# Altium project Rx_rev_B.PrjPcb
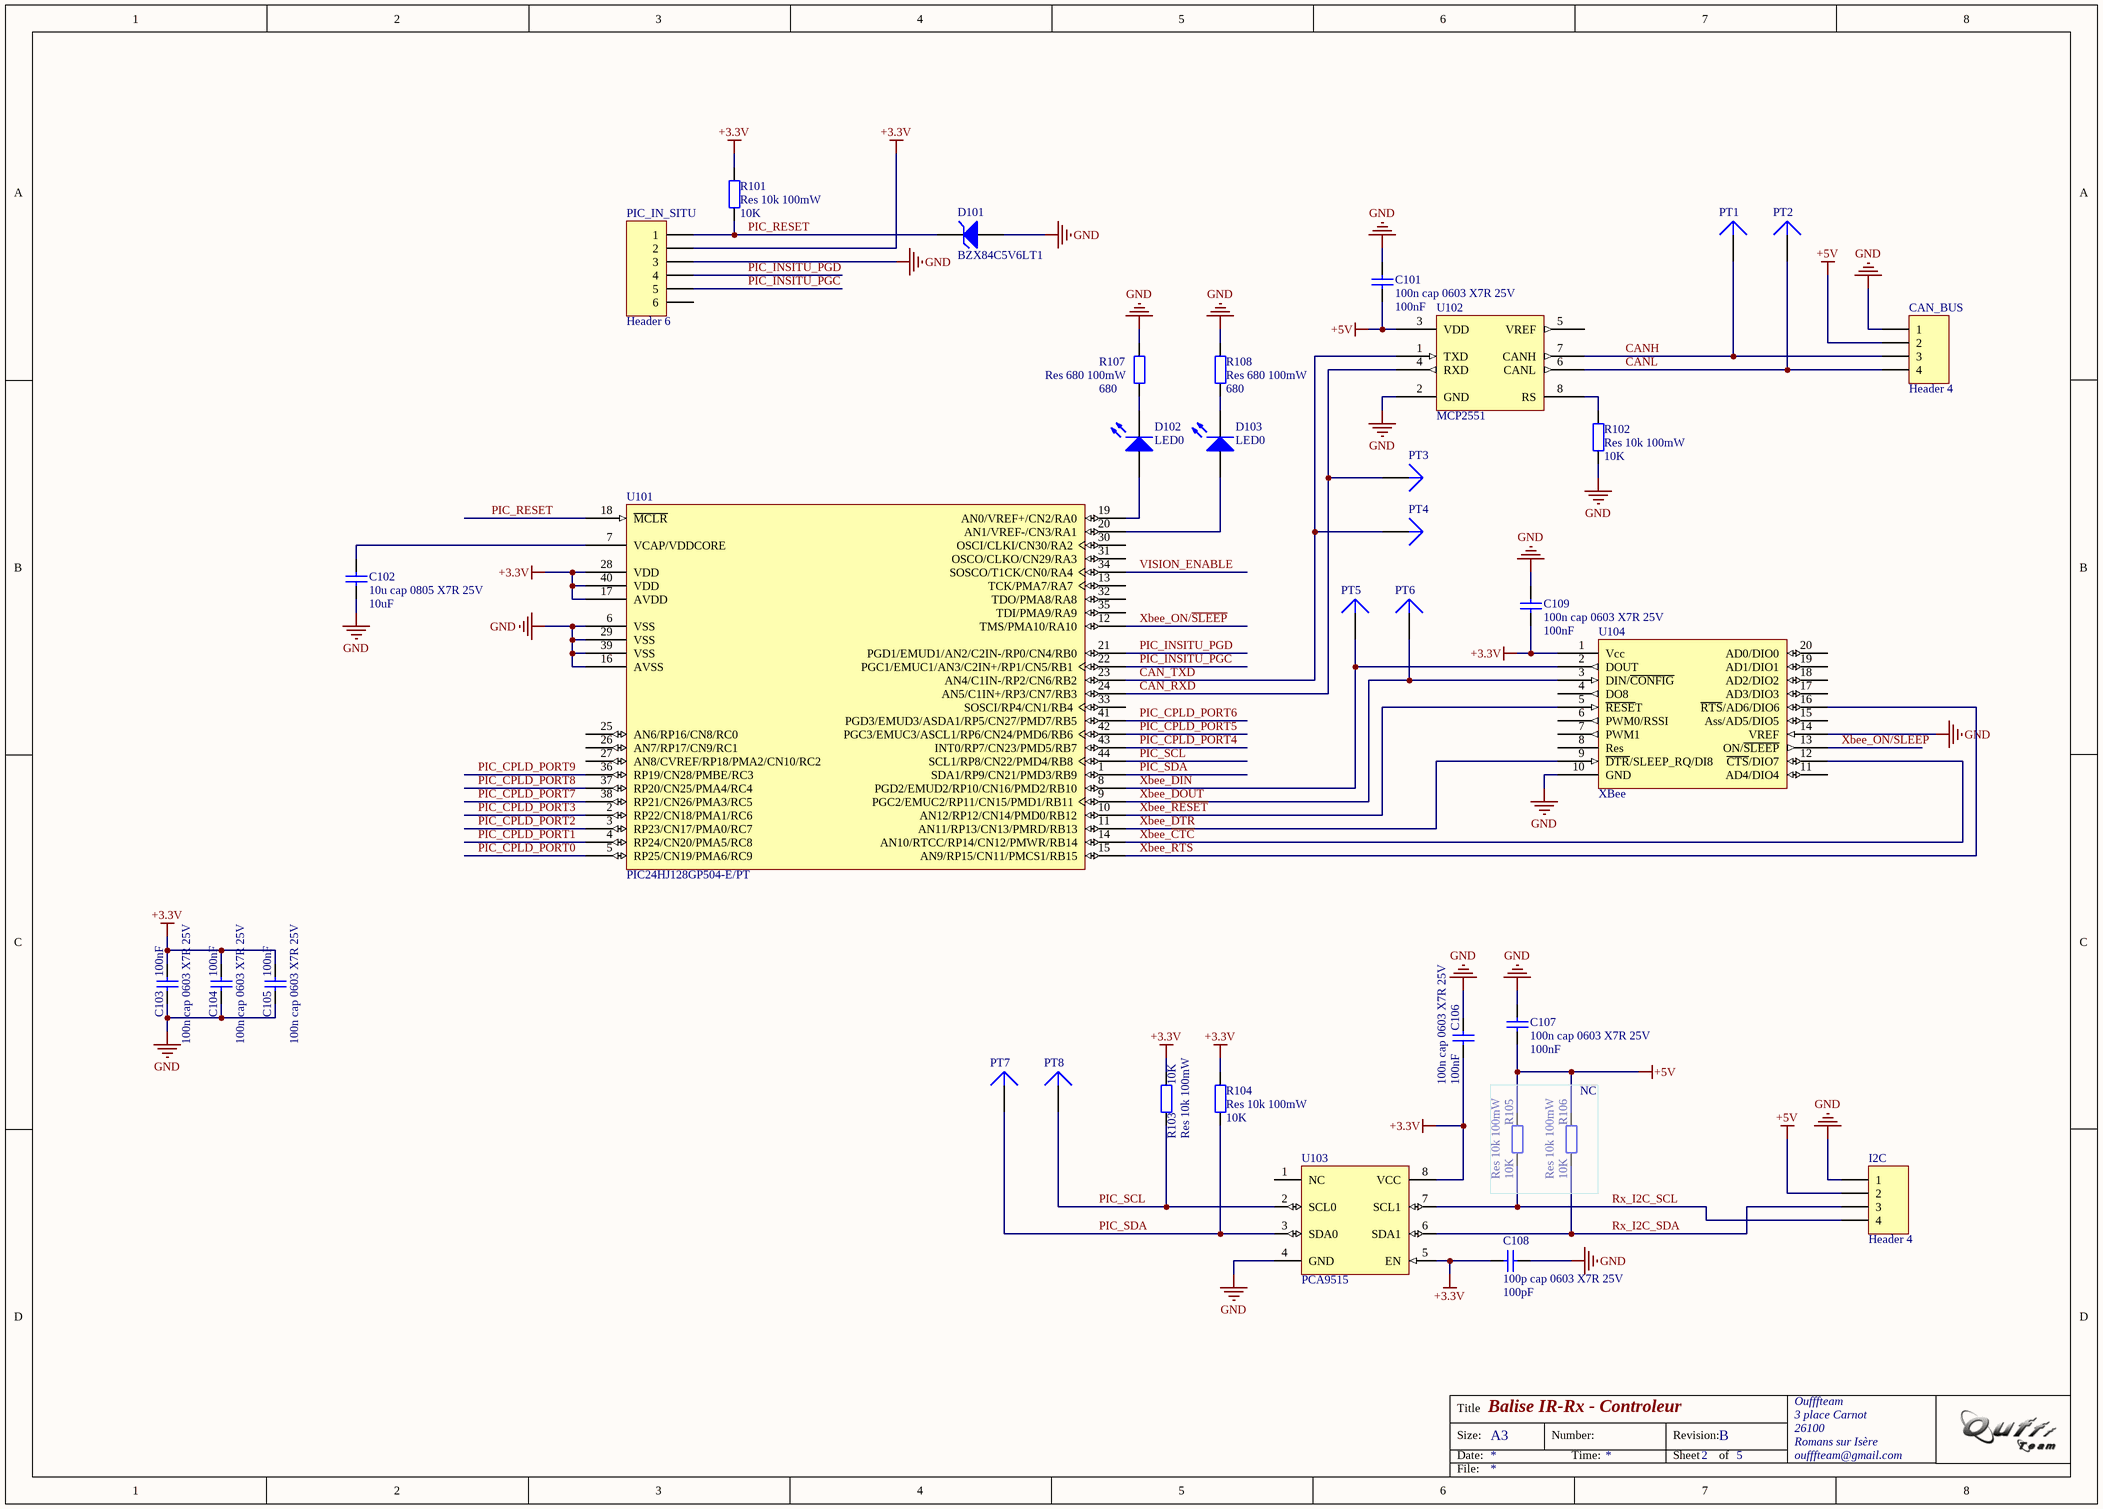
[diagram p0: Rx_micro.SchDoc]
5 sheets, 173 parts. Net scope: global (net labels, ports and power ports of the same name join across sheets).
Board file: Rx_pcb.PcbDoc
Sheets:
  Rx_micro.SchDoc
  Rx_logic.SchDoc
  Rx_power.SchDoc
  Rx_syno.SchDoc
  Rx_TSOP.SchDoc

## Sheet Rx_micro.SchDoc: Balise IR-Rx - Controleur
size A3; Author: B Labbe; CompanyName: Oufffteam; DrawnBy: B Labbe; Engineer: B Labbe; Organization: Oufffteam; Address1: L3, 12a Rodborough Rd; Address2: Frenchs Forest; Address3: NSW; Address4: Australia 2086; Revision: B; SheetNumber: 2; SheetTotal: 5; DocumentName: Balise IR-Rx - Controleur

### Parts
C101  100n cap 0603 X7R 25V  value 100nF  [0603]
C102  10u cap 0805 X7R 25V  value 10uF  [0805]
C103  100n cap 0603 X7R 25V  value 100nF  [0603]
C104  100n cap 0603 X7R 25V  value 100nF  [0603]
C105  100n cap 0603 X7R 25V  value 100nF  [0603]
C106  100n cap 0603 X7R 25V  value 100nF  [1608[0603]]
C107  100n cap 0603 X7R 25V  value 100nF  [1608[0603]]
C108  100p cap 0603 X7R 25V  value 100pF  [1608[0603]]
C109  100n cap 0603 X7R 25V  value 100nF  [0603]
CAN_BUS  Header 4  [HDR1X4]
D101  BZX84C5V6LT1  [318-07]
D102  LED0  [0603]
D103  LED0  [0603]
I2C  Header 4  [HDR1X4]
PIC_IN_SITU  Header 6  [HDR1X6]
PT1  Plug  [TP]  (value not drawn)
PT2  Plug  [TP]  (value not drawn)
PT3  Plug  [TP]  (value not drawn)
PT4  Plug  [TP]  (value not drawn)
PT5  Plug  [TP]  (value not drawn)
PT6  Plug  [TP]  (value not drawn)
PT7  Plug  [TP]  (value not drawn)
PT8  Plug  [TP]  (value not drawn)
R101  Res 10k 100mW  value 10K  [0603]
R102  Res 10k 100mW  value 10K  [0603]
R103  Res 10k 100mW  value 10K  [0603]
R104  Res 10k 100mW  value 10K  [0603]
R105  Res 10k 100mW  value 10K  [1608[0603]]
R106  Res 10k 100mW  value 10K  [1608[0603]]
R107  Res 680 100mW  value 680  [0603]
R108  Res 680 100mW  value 680  [0603]
U101  PIC24HJ128GP504-E/PT  [TQFP-PT44_N]
U102  MCP2551  [SOIC150-8_N]
U103  PCA9515  [TSSOP-8]
U104  XBee  [XBee_SM]

### Nets
+3.3V: C103.2 C104.2 C105.2 C106.1 C108.2 C109.1 PIC_IN_SITU.2 R101.2 R103.2 R104.2 U101.17(AVDD) U101.28(VDD) U101.40(VDD) U103.5(EN) U103.8(VCC) U104.1(Vcc)
+5V: C101.1 C107.2 CAN_BUS.2 I2C.2 R105.2 R106.2 U102.3(VDD)
GND: C101.2 C102.1 C103.1 C104.1 C105.1 C106.2 C107.1 C108.1 C109.2 CAN_BUS.1 D101.1(A) I2C.1 PIC_IN_SITU.3 R102.1 R107.2 R108.2 U101.6(VSS) U101.16(AVSS) U101.29(VSS) U101.39(VSS) U102.2(GND) U103.4(GND) U104.10(GND) U104.14(VREF)
CAN_RXD: PT3.1 U101.24(AN5/C1IN+/RP3/CN7/RB3) U102.4(RXD)
CAN_TXD: PT4.1 U101.23(AN4/C1IN-/RP2/CN6/RB2) U102.1(TXD)
CANH: CAN_BUS.3 PT1.1 U102.7(CANH)
CANL: CAN_BUS.4 PT2.1 U102.6(CANL)
PIC_CPLD_PORT0: U101.5(RP25/CN19/PMA6/RC9)
PIC_CPLD_PORT1: U101.4(RP24/CN20/PMA5/RC8)
PIC_CPLD_PORT2: U101.3(RP23/CN17/PMA0/RC7)
PIC_CPLD_PORT3: U101.2(RP22/CN18/PMA1/RC6)
PIC_CPLD_PORT4: U101.43(INT0/RP7/CN23/PMD5/RB7)
PIC_CPLD_PORT5: U101.42(PGC3/EMUC3/ASCL1/RP6/CN24/PMD6/RB6)
PIC_CPLD_PORT6: U101.41(PGD3/EMUD3/ASDA1/RP5/CN27/PMD7/RB5)
PIC_CPLD_PORT7: U101.38(RP21/CN26/PMA3/RC5)
PIC_CPLD_PORT8: U101.37(RP20/CN25/PMA4/RC4)
PIC_CPLD_PORT9: U101.36(RP19/CN28/PMBE/RC3)
PIC_INSITU_PGC: PIC_IN_SITU.5 U101.22(PGC1/EMUC1/AN3/C2IN+/RP1/CN5/RB1)
PIC_INSITU_PGD: PIC_IN_SITU.4 U101.21(PGD1/EMUD1/AN2/C2IN-/RP0/CN4/RB0)
PIC_RESET: D101.3(K) PIC_IN_SITU.1 R101.1 U101.18(~{MCLR})
PIC_SCL: PT8.1 R103.1 U101.44(SCL1/RP8/CN22/PMD4/RB8) U103.2(SCL0)
PIC_SDA: PT7.1 R104.1 U101.1(SDA1/RP9/CN21/PMD3/RB9) U103.3(SDA0)
Rx_I2C_SCL: I2C.4 R105.1 U103.7(SCL1)
Rx_I2C_SDA: I2C.3 R106.1 U103.6(SDA1)
VISION_ENABLE: U101.34(SOSCO/T1CK/CN0/RA4)
Xbee_~{CTC}: U101.14(AN10/RTCC/RP14/CN12/PMWR/RB14) U104.12(~{CTS}/DIO7)
Xbee_DIN: PT5.1 U101.8(PGD2/EMUD2/RP10/CN16/PMD2/RB10) U104.2(DOUT)
Xbee_DOUT: PT6.1 U101.9(PGC2/EMUC2/RP11/CN15/PMD1/RB11) U104.3(DIN/~{CONFIG})
Xbee_DTR: U101.11(AN11/RP13/CN13/PMRD/RB13) U104.9(~{DTR}/SLEEP_RQ/DI8)
Xbee_ON/~{SLEEP}: U101.12(TMS/PMA10/RA10) U104.13(ON/~{SLEEP})
Xbee_~{RESET}: U101.10(AN12/RP12/CN14/PMD0/RB12) U104.5(~{RESE}T)
Xbee_~{RTS}: U101.15(AN9/RP15/CN11/PMCS1/RB15) U104.16(~{RTS}/AD6/DIO6)
NetC102_2: C102.2 U101.7(VCAP/VDDCORE)
NetD102_1: D102.1(A) U101.19(AN0/VREF+/CN2/RA0)
NetD102_2: D102.2(K) R107.1
NetD103_1: D103.1(A) U101.20(AN1/VREF-/CN3/RA1)
NetD103_2: D103.2(K) R108.1
NetR102_2: R102.2 U102.8(RS)

Not connected (* = marked no-connect by the designer): PIC_IN_SITU 6; U101 13(TCK/PMA7/RA7) 25(AN6/RP16/CN8/RC0) 26(AN7/RP17/CN9/RC1) 27(AN8/CVREF/RP18/PMA2/CN10/RC2) 30(OSCI/CLKI/CN30/RA2) 31(OSCO/CLKO/CN29/RA3) 32(TDO/PMA8/RA8) 33(SOSCI/RP4/CN1/RB4) 35(TDI/PMA9/RA9); U102 5(VREF); U103 1(NC); U104 4(DO8) 6(PWM0/RSSI) 7(PWM1) 8(Res) 11(AD4/DIO4) 15(Ass/AD5/DIO5) 17(AD3/DIO3) 18(AD2/DIO2) 19(AD1/DIO1) 20(AD0/DIO0)

### Notes on the sheet
- (near R106) NC
- Title
- Size:
- Date:
- A3
- Number:
- Time:
- Revision:
- Sheet
- of
- Oufffteam
- 3 place Carnot
- 26100
- Romans sur Isère
- oufffteam@gmail.com
- File:

### Library data of the parts
C101-C109 = Cap: Capacitor; Published: 8-Jun-2000; LatestRevisionDate: 17-Jul-2002; LatestRevisionNote: Re-released for DXP Platform.; PackageReference: RAD-0.3; Publisher: Altium Limited
CAN_BUS I2C = Header 4: Header, 4-Pin; LatestRevisionDate: 17-Jul-2002; LatestRevisionNote: Re-released for DXP Platform.; Publisher: Altium Limited
D101 = BZX84C5V6LT1: Zener Voltage Regulator Diode; Note: Pin 2 is not connected and not drawn.; Published: 29-Sep-2000; LatestRevisionDate: 17-Jul-2002; LatestRevisionNote: Re-released for DXP Platform.; PackageReference: 318-07; Publisher: Altium Limited; PackageDescription: SOT-23; 3 Leads; Body 3.0 x 2.5 mm, inc. leads (LxW max); ComponentLink1Description: Manufacturer Link; ComponentLink1URL: http://www.onsemi.com/site/products/landing?taxonomyID=194; ComponentLink2Description: Datasheet; ComponentLink2URL: http://www.onsemi.com/pub/Collateral/BZX84C2V4LT1-D.PDF
D102 D103 = LED0: 0603 Led; Published: 8-Jun-2000; LatestRevisionDate: 08-Jul-2005; LatestRevisionNote: Mech Layer 1 removed.; PackageReference: LED-0; Publisher: Altium Limited
PIC_IN_SITU = Header 6: Header, 6-Pin; LatestRevisionDate: 17-Jul-2002; LatestRevisionNote: Re-released for DXP Platform.; Publisher: Altium Limited
R101-R108 = Res2: Resistor; Published: 8-Jun-2000; LatestRevisionDate: 17-Jul-2002; LatestRevisionNote: Re-released for DXP Platform.; PackageReference: AXIAL-0.4; Publisher: Altium Limited
U101 = PIC24HJ128GP504-E/PT: High Speed General Purpose 16-Bit Flash Microcontroller, 128KB Flash, 8KB RAM, 44-Pin TQFP, Extended Temperature; Published: 29-Jan-2009; DatasheetVersion: revB, Mar-2008; PackageVersion: revAW, Oct-2008; PackageReference: TQFP-PT44; Publisher: Altium Limited; PackageDescription: 44-Lead Plastic Thin Quad Flatpack (PT) - 10x10x1mm Body, 2.00mm [TQFP]; Code_JEDEC: MS-026; ComponentLink1Description: Manufacturer Link; ComponentLink1URL: http://www.microchip.com; ComponentLink2Description: Datasheet; ComponentLink2URL: http://ww1.microchip.com/downloads/en/DeviceDoc/70293B.pdf; ComponentLink3Description: Packaging Specification; ComponentLink3URL: http://ww1.microchip.com/downloads/en/PackagingSpec/00049AW.pdf
U102 = MCP2551: High Speed Can Transceiver; Published: 6-Oct-2005; LatestRevisionDate: 13-Apr-2006; LatestRevisionNote: IPC-7351 Footprint Added.; DatasheetVersion: Nov-2003; PackageVersion: Oct-2005; PackageReference: SOIC150-8; Publisher: Altium Limited; PackageDescription: 8-Pin Plastic Narrow Body Small Outline Integrated Circuit 1.27 mm Pitch; Code_JEDEC: MS-012; ComponentLink1Description: Manufacturer Link; ComponentLink1URL: http://www.microchip.com; ComponentLink2Description: Datasheet; ComponentLink2URL: http://ww1.microchip.com/downloads/en/DeviceDoc/21667d.pdf
U103 = PCA9515: DUAL BIDIRECTIONAL I2C BUS AND SMBus REPEATER
U104 = XBee: OEM RF Modules
PT1-PT8 = Plug: LatestRevisionDate: 17-Jul-2002; LatestRevisionNote: Re-released for DXP Platform.; Publisher: Altium Limited

## Sheet Rx_logic.SchDoc: Balise IR-Rx - Logic
size A3; Author: B Labbe; CompanyName: Oufffteam; DrawnBy: B Labbe; Engineer: B Labbe; Organization: Oufffteam; Address1: L3, 12a Rodborough Rd; Address2: Frenchs Forest; Address3: NSW; Address4: Australia 2086; Revision: B; SheetNumber: 3; SheetTotal: 5; DocumentName: Balise IR-Rx - Logic
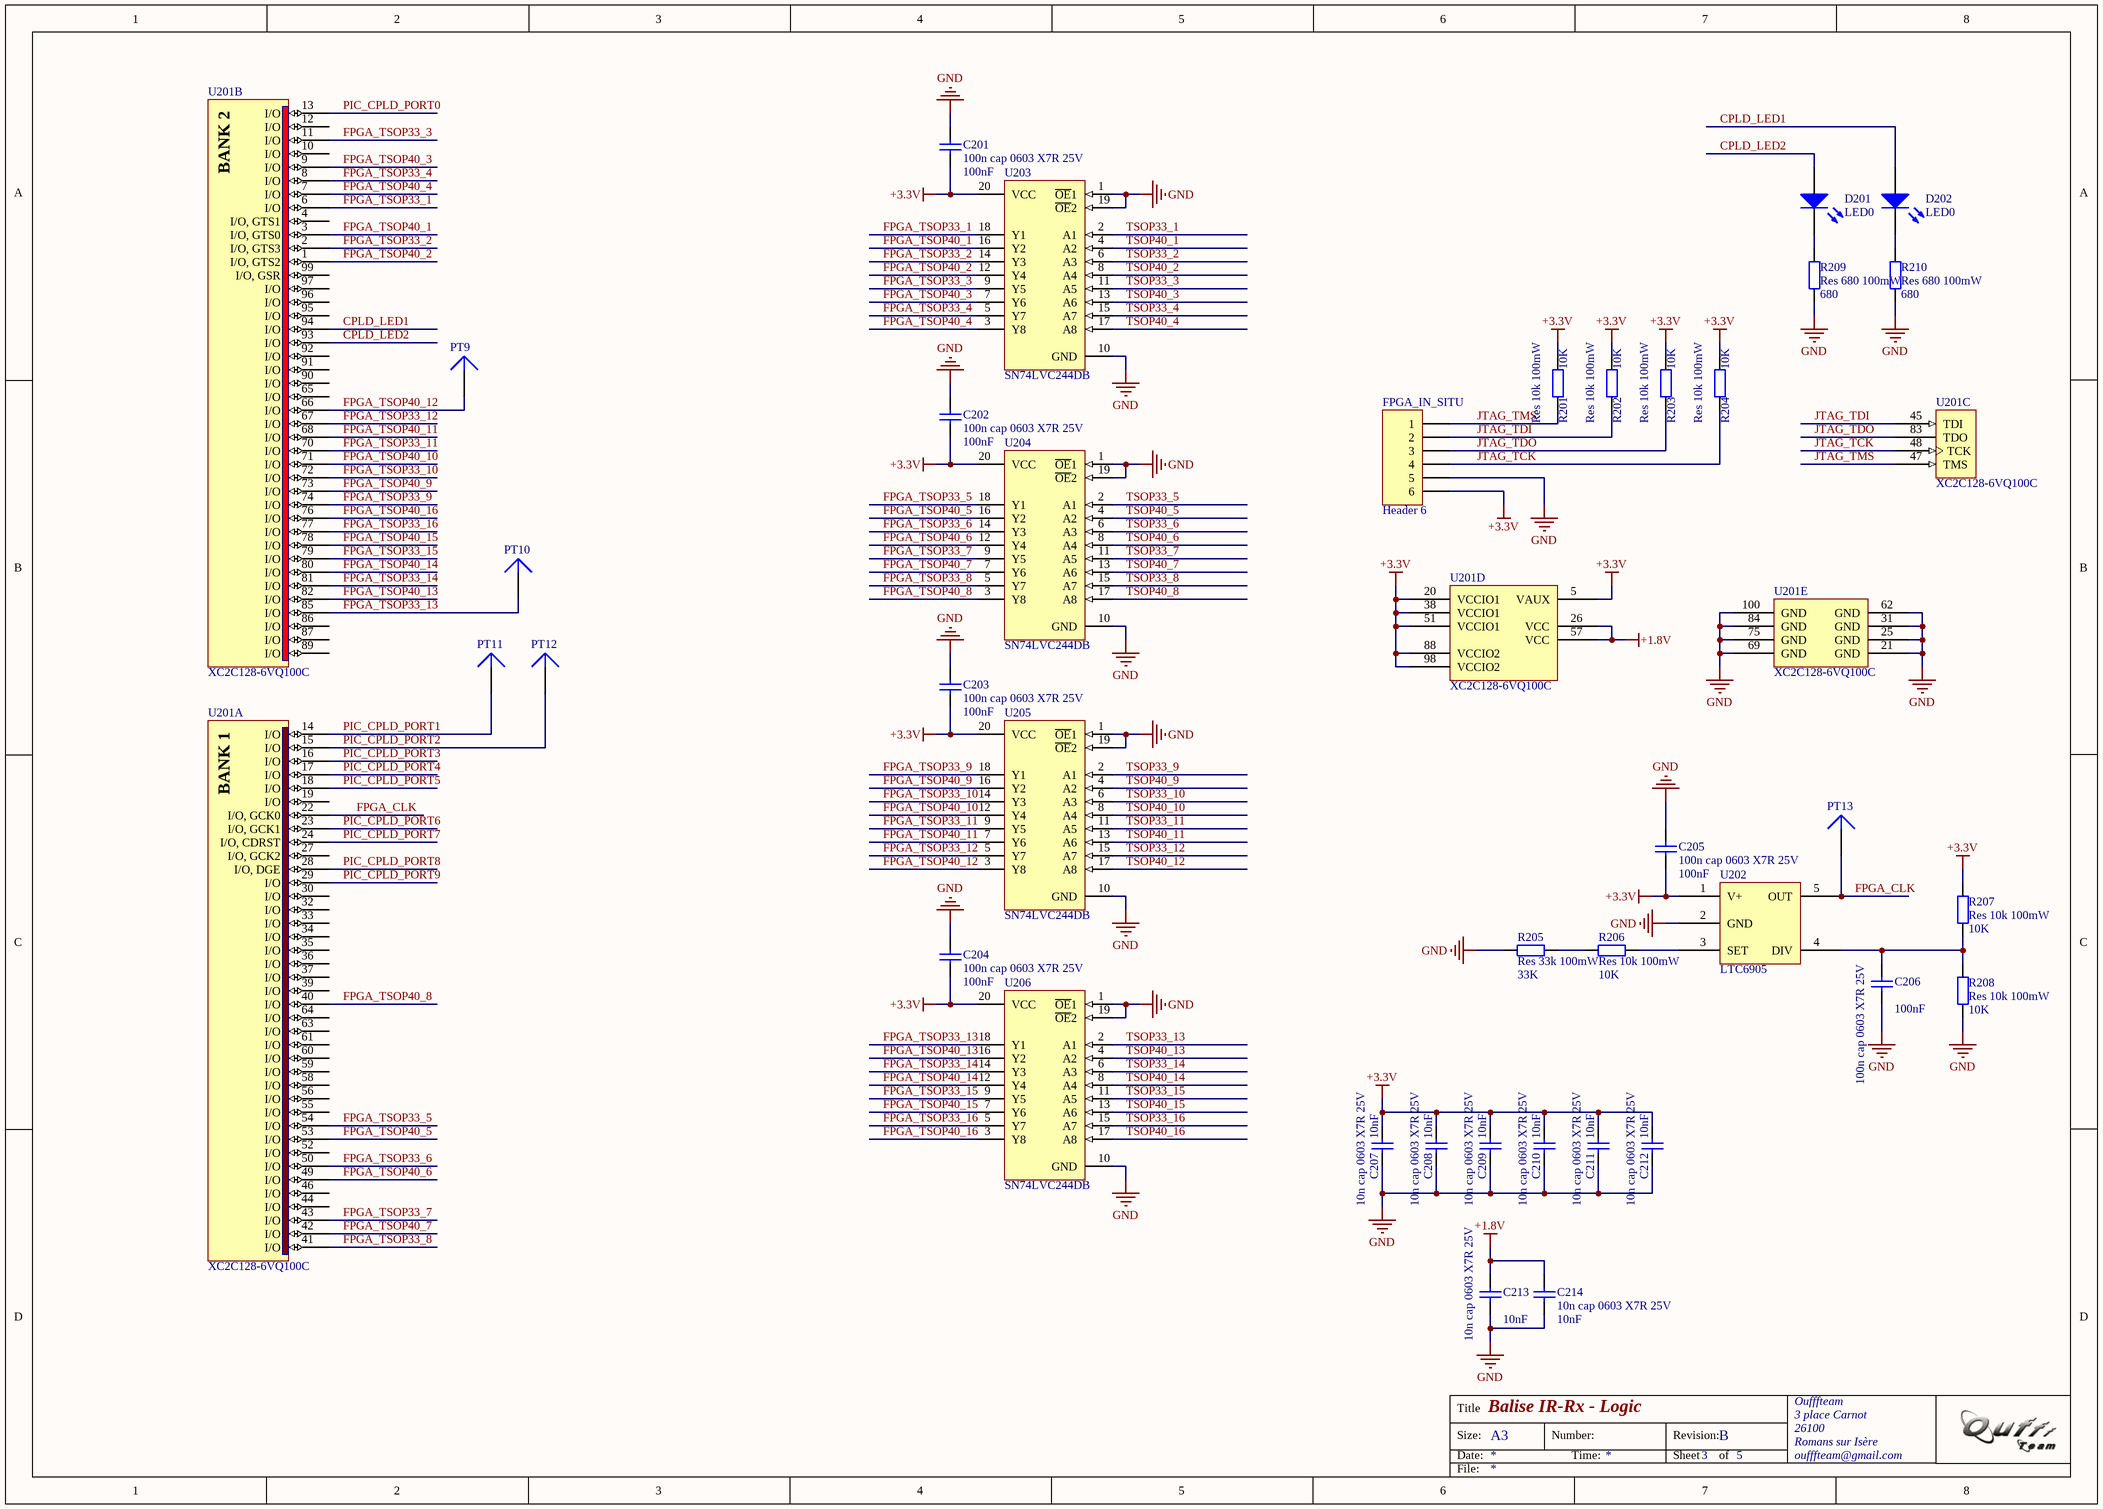
[diagram p1: Rx_logic.SchDoc]

### Parts
C201  100n cap 0603 X7R 25V  value 100nF  [0603]
C202  100n cap 0603 X7R 25V  value 100nF  [0603]
C203  100n cap 0603 X7R 25V  value 100nF  [0603]
C204  100n cap 0603 X7R 25V  value 100nF  [0603]
C205  100n cap 0603 X7R 25V  value 100nF  [0603]
C206  100n cap 0603 X7R 25V  value 100nF  [0603]
C207  10n cap 0603 X7R 25V  value 10nF  [0603]
C208  10n cap 0603 X7R 25V  value 10nF  [0603]
C209  10n cap 0603 X7R 25V  value 10nF  [0603]
C210  10n cap 0603 X7R 25V  value 10nF  [0603]
C211  10n cap 0603 X7R 25V  value 10nF  [0603]
C212  10n cap 0603 X7R 25V  value 10nF  [0603]
C213  10n cap 0603 X7R 25V  value 10nF  [0603]
C214  10n cap 0603 X7R 25V  value 10nF  [0603]
D201  LED0  [0603]
D202  LED0  [0603]
FPGA_IN_SITU  Header 6  [HDR1X6]
PT9  Plug  [TP]  (value not drawn)
PT10  Plug  [TP]  (value not drawn)
PT11  Plug  [TP]  (value not drawn)
PT12  Plug  [TP]  (value not drawn)
PT13  Plug  [TP]  (value not drawn)
R201  Res 10k 100mW  value 10K  [0603]
R202  Res 10k 100mW  value 10K  [0603]
R203  Res 10k 100mW  value 10K  [0603]
R204  Res 10k 100mW  value 10K  [0603]
R205  Res 33k 100mW  value 33K  [0603]
R206  Res 10k 100mW  value 10K  [0603]
R207  Res 10k 100mW  value 10K  [0603]
R208  Res 10k 100mW  value 10K  [0603]
R209  Res 680 100mW  value 680  [0603]
R210  Res 680 100mW  value 680  [0603]
U201  XC2C128-6VQ100C  [VQ100_N]  (parts A,B,C,D,E of 5)
U202  LTC6905  [SOT23-5]
U203  SN74LVC244DB  [DB020_N]
U204  SN74LVC244DB  [DB020_N]
U205  SN74LVC244DB  [DB020_N]
U206  SN74LVC244DB  [DB020_N]

### Nets
+1.8V: C213.2 C214.2 U201.26(VCC) U201.57(VCC)
+3.3V: C201.1 C202.1 C203.1 C204.1 C205.1 C207.2 C208.2 C209.2 C210.2 C211.2 C212.2 FPGA_IN_SITU.6 R201.2 R202.2 R203.2 R204.2 R207.2 U201.5(VAUX) U201.20(VCCIO1) U201.38(VCCIO1) U201.51(VCCIO1) U201.88(VCCIO2) U201.98(VCCIO2) U202.1(V+) U203.20(VCC) U204.20(VCC) U205.20(VCC) U206.20(VCC)
GND: C201.2 C202.2 C203.2 C204.2 C205.2 C206.1 C207.1 C208.1 C209.1 C210.1 C211.1 C212.1 C213.1 C214.1 FPGA_IN_SITU.5 R205.1 R208.1 R209.2 R210.2 U201.21(GND) U201.25(GND) U201.31(GND) U201.62(GND) U201.69(GND) U201.75(GND) U201.84(GND) U201.100(GND) U202.2(GND) U203.1(~{OE}1) U203.10(GND) U203.19(~{OE}2) U204.1(~{OE}1) U204.10(GND) U204.19(~{OE}2) U205.1(~{OE}1) U205.10(GND) U205.19(~{OE}2) U206.1(~{OE}1) U206.10(GND) U206.19(~{OE}2)
CPLD_LED1: D202.1(A) U201.94(I/O)
CPLD_LED2: D201.1(A) U201.93(I/O)
FPGA_CLK: PT13.1 U201.22(I/O,_GCK0) U202.5(OUT)
FPGA_TSOP33_1: U201.6(I/O) U203.18(Y1)
FPGA_TSOP33_2: U201.2(I/O,_GTS3) U203.14(Y3)
FPGA_TSOP33_3: U201.11(I/O) U203.9(Y5)
FPGA_TSOP33_4: U201.8(I/O) U203.5(Y7)
FPGA_TSOP33_5: U201.54(I/O) U204.18(Y1)
FPGA_TSOP33_6: U201.50(I/O) U204.14(Y3)
FPGA_TSOP33_7: U201.43(I/O) U204.9(Y5)
FPGA_TSOP33_8: U201.41(I/O) U204.5(Y7)
FPGA_TSOP33_9: U201.74(I/O) U205.18(Y1)
FPGA_TSOP33_10: U201.72(I/O) U205.14(Y3)
FPGA_TSOP33_11: U201.70(I/O) U205.9(Y5)
FPGA_TSOP33_12: U201.67(I/O) U205.5(Y7)
FPGA_TSOP33_13: PT10.1 U201.85(I/O) U206.18(Y1)
FPGA_TSOP33_14: U201.81(I/O) U206.14(Y3)
FPGA_TSOP33_15: U201.79(I/O) U206.9(Y5)
FPGA_TSOP33_16: U201.77(I/O) U206.5(Y7)
FPGA_TSOP40_1: U201.3(I/O,_GTS0) U203.16(Y2)
FPGA_TSOP40_2: U201.1(I/O,_GTS2) U203.12(Y4)
FPGA_TSOP40_3: U201.9(I/O) U203.7(Y6)
FPGA_TSOP40_4: U201.7(I/O) U203.3(Y8)
FPGA_TSOP40_5: U201.53(I/O) U204.16(Y2)
FPGA_TSOP40_6: U201.49(I/O) U204.12(Y4)
FPGA_TSOP40_7: U201.42(I/O) U204.7(Y6)
FPGA_TSOP40_8: U201.40(I/O) U204.3(Y8)
FPGA_TSOP40_9: U201.73(I/O) U205.16(Y2)
FPGA_TSOP40_10: U201.71(I/O) U205.12(Y4)
FPGA_TSOP40_11: U201.68(I/O) U205.7(Y6)
FPGA_TSOP40_12: PT9.1 U201.66(I/O) U205.3(Y8)
FPGA_TSOP40_13: U201.82(I/O) U206.16(Y2)
FPGA_TSOP40_14: U201.80(I/O) U206.12(Y4)
FPGA_TSOP40_15: U201.78(I/O) U206.7(Y6)
FPGA_TSOP40_16: U201.76(I/O) U206.3(Y8)
JTAG_TCK: FPGA_IN_SITU.4 R204.1 U201.48(TCK)
JTAG_TDI: FPGA_IN_SITU.2 R202.1 U201.45(TDI)
JTAG_TDO: FPGA_IN_SITU.3 R203.1 U201.83(TDO)
JTAG_TMS: FPGA_IN_SITU.1 R201.1 U201.47(TMS)
PIC_CPLD_PORT0: U201.13(I/O)
PIC_CPLD_PORT1: PT11.1 U201.14(I/O)
PIC_CPLD_PORT2: PT12.1 U201.15(I/O)
PIC_CPLD_PORT3: U201.16(I/O)
PIC_CPLD_PORT4: U201.17(I/O)
PIC_CPLD_PORT5: U201.18(I/O)
PIC_CPLD_PORT6: U201.23(I/O,_GCK1)
PIC_CPLD_PORT7: U201.24(I/O,_CDRST)
PIC_CPLD_PORT8: U201.28(I/O,_DGE)
PIC_CPLD_PORT9: U201.29(I/O)
TSOP33_1: U203.2(A1)
TSOP33_2: U203.6(A3)
TSOP33_3: U203.11(A5)
TSOP33_4: U203.15(A7)
TSOP33_5: U204.2(A1)
TSOP33_6: U204.6(A3)
TSOP33_7: U204.11(A5)
TSOP33_8: U204.15(A7)
TSOP33_9: U205.2(A1)
TSOP33_10: U205.6(A3)
TSOP33_11: U205.11(A5)
TSOP33_12: U205.15(A7)
TSOP33_13: U206.2(A1)
TSOP33_14: U206.6(A3)
TSOP33_15: U206.11(A5)
TSOP33_16: U206.15(A7)
TSOP40_1: U203.4(A2)
TSOP40_2: U203.8(A4)
TSOP40_3: U203.13(A6)
TSOP40_4: U203.17(A8)
TSOP40_5: U204.4(A2)
TSOP40_6: U204.8(A4)
TSOP40_7: U204.13(A6)
TSOP40_8: U204.17(A8)
TSOP40_9: U205.4(A2)
TSOP40_10: U205.8(A4)
TSOP40_11: U205.13(A6)
TSOP40_12: U205.17(A8)
TSOP40_13: U206.4(A2)
TSOP40_14: U206.8(A4)
TSOP40_15: U206.13(A6)
TSOP40_16: U206.17(A8)
NetC206_2: C206.2 R207.1 R208.2 U202.4(DIV)
NetD201_2: D201.2(K) R209.1
NetD202_2: D202.2(K) R210.1
NetR205_2: R205.2 R206.1
NetR206_2: R206.2 U202.3(SET)

Not connected (* = marked no-connect by the designer): U201 4(I/O,_GTS1) 10(I/O) 12(I/O) 19(I/O) 27(I/O,_GCK2) 30(I/O) 32(I/O) 33(I/O) 34(I/O) 35(I/O) 36(I/O) 37(I/O) 39(I/O) 44(I/O) 46(I/O) 52(I/O) 55(I/O) 56(I/O) 58(I/O) 59(I/O) 60(I/O) 61(I/O) 63(I/O) 64(I/O) 65(I/O) 86(I/O) 87(I/O) 89(I/O) 90(I/O) 91(I/O) 92(I/O) 95(I/O) 96(I/O) 97(I/O) 99(I/O,_GSR)

### Notes on the sheet
- Title
- Size:
- Date:
- A3
- Number:
- Time:
- Revision:
- Sheet
- of
- Oufffteam
- 3 place Carnot
- 26100
- Romans sur Isère
- oufffteam@gmail.com
- File:
- (in symbol XC2C128-6VQ100C, part A) BANK 1
- (in symbol XC2C128-6VQ100C, part B) BANK 2

### Library data of the parts
C201-C214 = Cap: Capacitor; Published: 8-Jun-2000; LatestRevisionDate: 17-Jul-2002; LatestRevisionNote: Re-released for DXP Platform.; PackageReference: RAD-0.3; Publisher: Altium Limited
D201 D202 = LED0: 0603 Led; Published: 8-Jun-2000; LatestRevisionDate: 08-Jul-2005; LatestRevisionNote: Mech Layer 1 removed.; PackageReference: LED-0; Publisher: Altium Limited
FPGA_IN_SITU = Header 6: Header, 6-Pin; LatestRevisionDate: 17-Jul-2002; LatestRevisionNote: Re-released for DXP Platform.; Publisher: Altium Limited
R201-R210 = Res2: Resistor; Published: 8-Jun-2000; LatestRevisionDate: 17-Jul-2002; LatestRevisionNote: Re-released for DXP Platform.; PackageReference: AXIAL-0.4; Publisher: Altium Limited
U201 = XC2C128-6VQ100C: CoolRunner-II, 1.8V, 128 Macrocell CPLD, 100-Pin VQFP, Commercial Grade; ComponentAvailability: Not referenced in latest datasheet.; Published: 23-Sep-2002; LatestRevisionDate: 13-Apr-2006; LatestRevisionNote: IPC-7351 Footprint Added.; DatasheetVersion: ver2.5, Oct-2004; PackageVersion: ver1.2.1, Feb-2007; PackageReference: VQ100; Publisher: Altium Limited; PackageDescription: 100-Pin Very Thin Quad Flat Pack (VQ100); Code_JEDEC: MS-026-AED; ComponentLink1Description: Manufacturer Link; ComponentLink1URL: http://www.xilinx.com/products/silicon_solutions/cplds/coolrunner_series/coolrunner_ii_cplds/overview.htm; ComponentLink2Description: Datasheet; ComponentLink2URL: http://direct.xilinx.com/bvdocs/publications/ds093.pdf
U202 = LTC6905: 17MHz to 170MHz Resistor Set SOT-23 Oscillator
U203-U206 = SN74LVC244DB: Octal Buffer/Driver with 3-State Outputs; ComponentAvailability: Obsolete; Published: 8-Jun-2000; LatestRevisionDate: 16-Oct-2006; LatestRevisionNote: IPC-7351 Footprint Added.; DatasheetVersion: Mar-1994; PackageVersion: May-1999; PackageReference: DB020; Publisher: Altium Limited; PackageDescription: 20-Pin Plastic Small Outline Package 0.65 mm Pitch; Code_JEDEC: MO-150-AE; Code_IPC: SOP65P780-20; ComponentLink1Description: Manufacturer Link; ComponentLink1URL: http://www.ti.com/; ComponentLink2Description: Discontinuation Notice; ComponentLink2URL: http://focus.ti.com/docs/prod/folders/print/sn74lvc244.html
PT9-PT13 = Plug: LatestRevisionDate: 17-Jul-2002; LatestRevisionNote: Re-released for DXP Platform.; Publisher: Altium Limited

## Sheet Rx_power.SchDoc: Balise IR-Rx - Power
size A3; Author: B Labbe; CompanyName: Oufffteam; DrawnBy: B Labbe; Engineer: B Labbe; Organization: Oufffteam; Address1: L3, 12a Rodborough Rd; Address2: Frenchs Forest; Address3: NSW; Address4: Australia 2086; Revision: B; SheetNumber: 4; SheetTotal: 5; DocumentName: Balise IR-Rx - Power
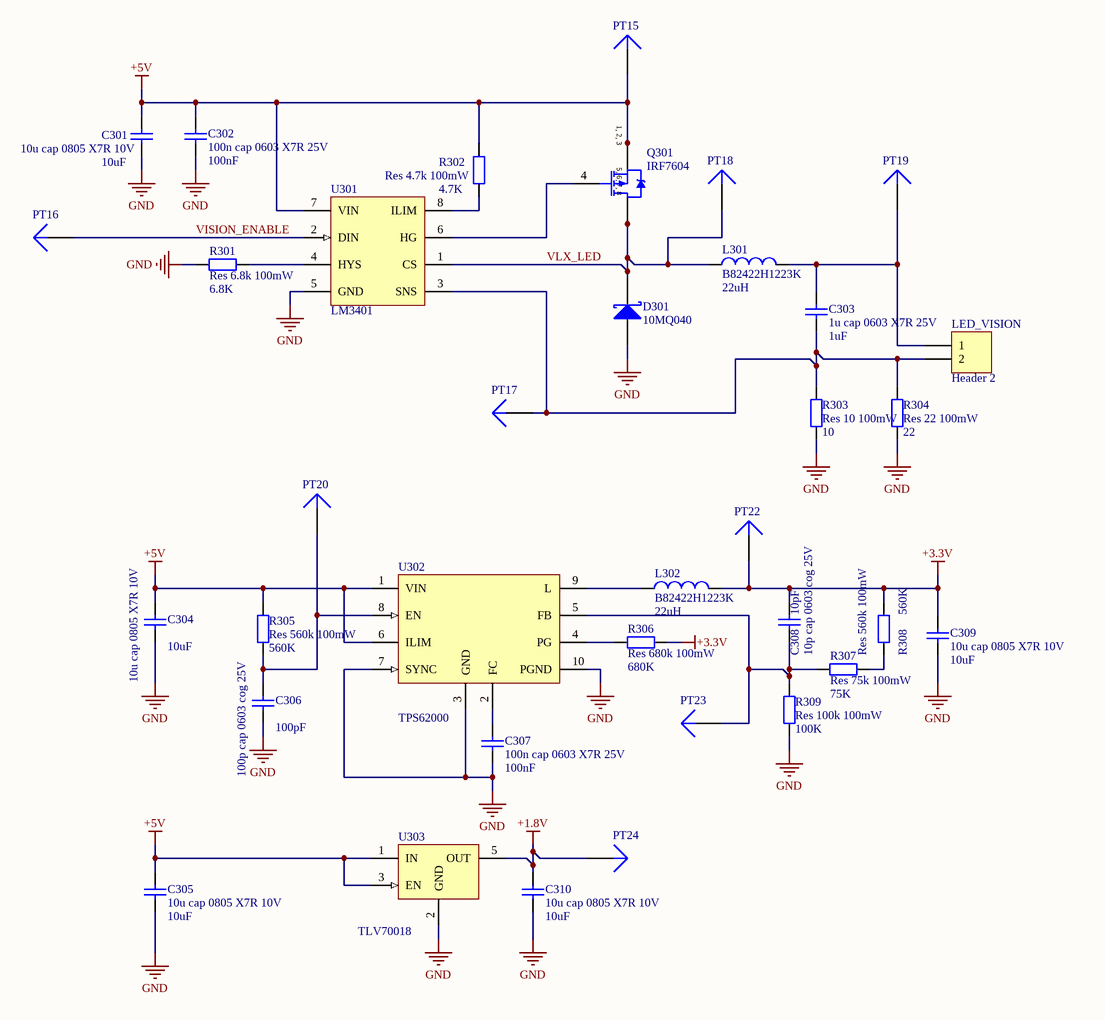
[diagram p2: Rx_power.SchDoc]

### Parts
C301  10u cap 0805 X7R 10V  value 10uF  [0805]
C302  100n cap 0603 X7R 25V  value 100nF  [0603]
C303  1u cap 0603 X7R 25V  value 1uF  [0603]
C304  10u cap 0805 X7R 10V  value 10uF  [0805]
C305  10u cap 0805 X7R 10V  value 10uF  [0805]
C306  100p cap 0603 cog 25V  value 100pF  [0603]
C307  100n cap 0603 X7R 25V  value 100nF  [0603]
C308  10p cap 0603 cog 25V  value 10pF  [0603]
C309  10u cap 0805 X7R 10V  value 10uF  [0805]
C310  10u cap 0805 X7R 10V  value 10uF  [0805]
D301  10MQ040  [D-64]
L301  B82422H1223K  value 22uH  [1210]
L302  B82422H1223K  value 22uH  [1210]
LED_VISION  Header 2  [HDR1X2]
PT15  Plug  [TP]  (value not drawn)
PT16  Plug  [TP]  (value not drawn)
PT17  Plug  [TP]  (value not drawn)
PT18  Plug  [TP]  (value not drawn)
PT19  Plug  [TP]  (value not drawn)
PT20  Plug  [TP]  (value not drawn)
PT22  Plug  [TP]  (value not drawn)
PT23  Plug  [TP]  (value not drawn)
PT24  Plug  [TP]  (value not drawn)
Q301  IRF7604  [Micro8]
R301  Res 6.8k 100mW  value 6.8K  [0603]
R302  Res 4.7k 100mW  value 4.7K  [0603]
R303  Res 10 100mW  value 10  [0603]
R304  Res 22 100mW  value 22  [0603]
R305  Res 560k 100mW  value 560K  [0603]
R306  Res 680k 100mW  value 680K  [0603]
R307  Res 75k 100mW  value 75K  [0603]
R308  Res 560k 100mW  value 560K  [0603]
R309  Res 100k 100mW  value 100K  [0603]
U301  LM3401  [MSOP8]
U302  TPS62000  [MS10]
U303  TLV70018  [SOT23-5]

### Nets
+1.8V: C310.2 PT24.1 U303.5(OUT)
+3.3V: C308.2 C309.2 L302.2 PT22.1 R306.2 R308.2
+5V: C301.2 C302.2 C304.2 C305.2 PT15.1 Q301.1(S) Q301.2(S) Q301.3(S) R302.2 R305.2 U301.7(VIN) U302.1(VIN) U302.6(ILIM) U303.1(IN) U303.3(EN)
GND: C301.1 C302.1 C304.1 C305.1 C306.1 C307.1 C309.1 C310.1 D301.1(A) R301.1 R303.1 R304.1 R309.1 U301.5(GND) U302.3(GND) U302.7(SYNC) U302.10(PGND) U303.2(GND)
VISION_ENABLE: PT16.1 U301.2(DIN)
VLX_LED: D301.2(K) L301.1 PT18.1 Q301.5(D) Q301.6(D) Q301.7(D) Q301.8(D) U301.1(CS)
NetC303_1: C303.1 LED_VISION.2 PT17.1 R303.2 R304.2 U301.3(SNS)
NetC303_2: C303.2 L301.2 LED_VISION.1 PT19.1
NetC306_2: C306.2 PT20.1 R305.1 U302.8(EN)
NetC307_2: C307.2 U302.2(FC)
NetC308_1: C308.1 PT23.1 R307.1 R309.2 U302.5(FB)
NetL302_1: L302.1 U302.9(L)
NetQ301_4: Q301.4(G) U301.6(HG)
NetR301_2: R301.2 U301.4(HYS)
NetR302_1: R302.1 U301.8(ILIM)
NetR306_1: R306.1 U302.4(PG)
NetR307_2: R307.2 R308.1

### Notes on the sheet
- Title
- Size:
- Date:
- A3
- Number:
- Time:
- Revision:
- Sheet
- of
- Oufffteam
- 3 place Carnot
- 26100
- Romans sur Isère
- oufffteam@gmail.com
- File:
- (in symbol IRF7604) 1, 2, 3; 5, 6, 7, 8

### Library data of the parts
C301-C310 = Cap: Capacitor; Published: 8-Jun-2000; LatestRevisionDate: 17-Jul-2002; LatestRevisionNote: Re-released for DXP Platform.; PackageReference: RAD-0.3; Publisher: Altium Limited
D301 = 10MQ040: Schottky Rectifier; Published: 8-Jun-2000; LatestRevisionDate: 17-Jul-2002; LatestRevisionNote: Re-released for DXP Platform.; DatasheetDocument: Dec-1997; PackageReference: D-64; Publisher: Altium Limited; ComponentLink1Description: Manufacturer Link; ComponentLink1URL: http://www.irf.com/; ComponentLink2Description: Datasheet; ComponentLink2URL: http://www.irf.com/product-info/datasheets/data/10mq040n.pdf
L301 L302 = Inductor: Code_IEC: 1005; Published: 8-Jun-2000; LatestRevisionDate: 17-Jul-2002; LatestRevisionNote: Re-released for DXP Platform.; PackageReference: 0402-A; Publisher: Altium Limited; Code_JEITA: 0402
LED_VISION = Header 2: Header, 2-Pin; LatestRevisionDate: 17-Jul-2002; LatestRevisionNote: Re-released for DXP Platform.; Publisher: Altium Limited
Q301 = IRF7604: HEXFET Power MOSFET; Published: 8-Jun-2000; LatestRevisionDate: 04-Mar-2005; LatestRevisionNote: Stylized 3D Model Added.; DatasheetVersion: Dec-1997; PackageReference: Micro8; Publisher: Altium Limited; PackageDescription: Shrink Small Outline; 8 Leads; Body Width 3 mm; Pitch 0.65 mm; ComponentLink1Description: Manufacturer Link; ComponentLink1URL: http://www.irf.com/; ComponentLink2Description: Datasheet; ComponentLink2URL: http://www.irf.com/product-info/datasheets/data/irf7604.pdf
R301-R309 = Res2: Resistor; Published: 8-Jun-2000; LatestRevisionDate: 17-Jul-2002; LatestRevisionNote: Re-released for DXP Platform.; PackageReference: AXIAL-0.4; Publisher: Altium Limited
U301 = LM3401: Hysteretic PFET Controller for High Power LED Drive
U302 = TPS6200x: HIGH-EFFICIENCY STEP-DOWN LOW POWER DC-DC CONVERTER
U303 = TLV700xx: 200-mA, Low-IQ, Low-Dropout Regulator for Portable Devices
PT15-PT20 PT22-PT24 = Plug: LatestRevisionDate: 17-Jul-2002; LatestRevisionNote: Re-released for DXP Platform.; Publisher: Altium Limited

## Sheet Rx_syno.SchDoc: Balise IR-Rx - Synoptique
size A3; Author: B Labbe; CompanyName: Oufffteam; DrawnBy: B Labbe; Engineer: B Labbe; Organization: Oufffteam; Address1: L3, 12a Rodborough Rd; Address2: Frenchs Forest; Address3: NSW; Address4: Australia 2086; Revision: B; SheetNumber: 1; SheetTotal: 5; DocumentName: Balise IR-Rx - Synoptique
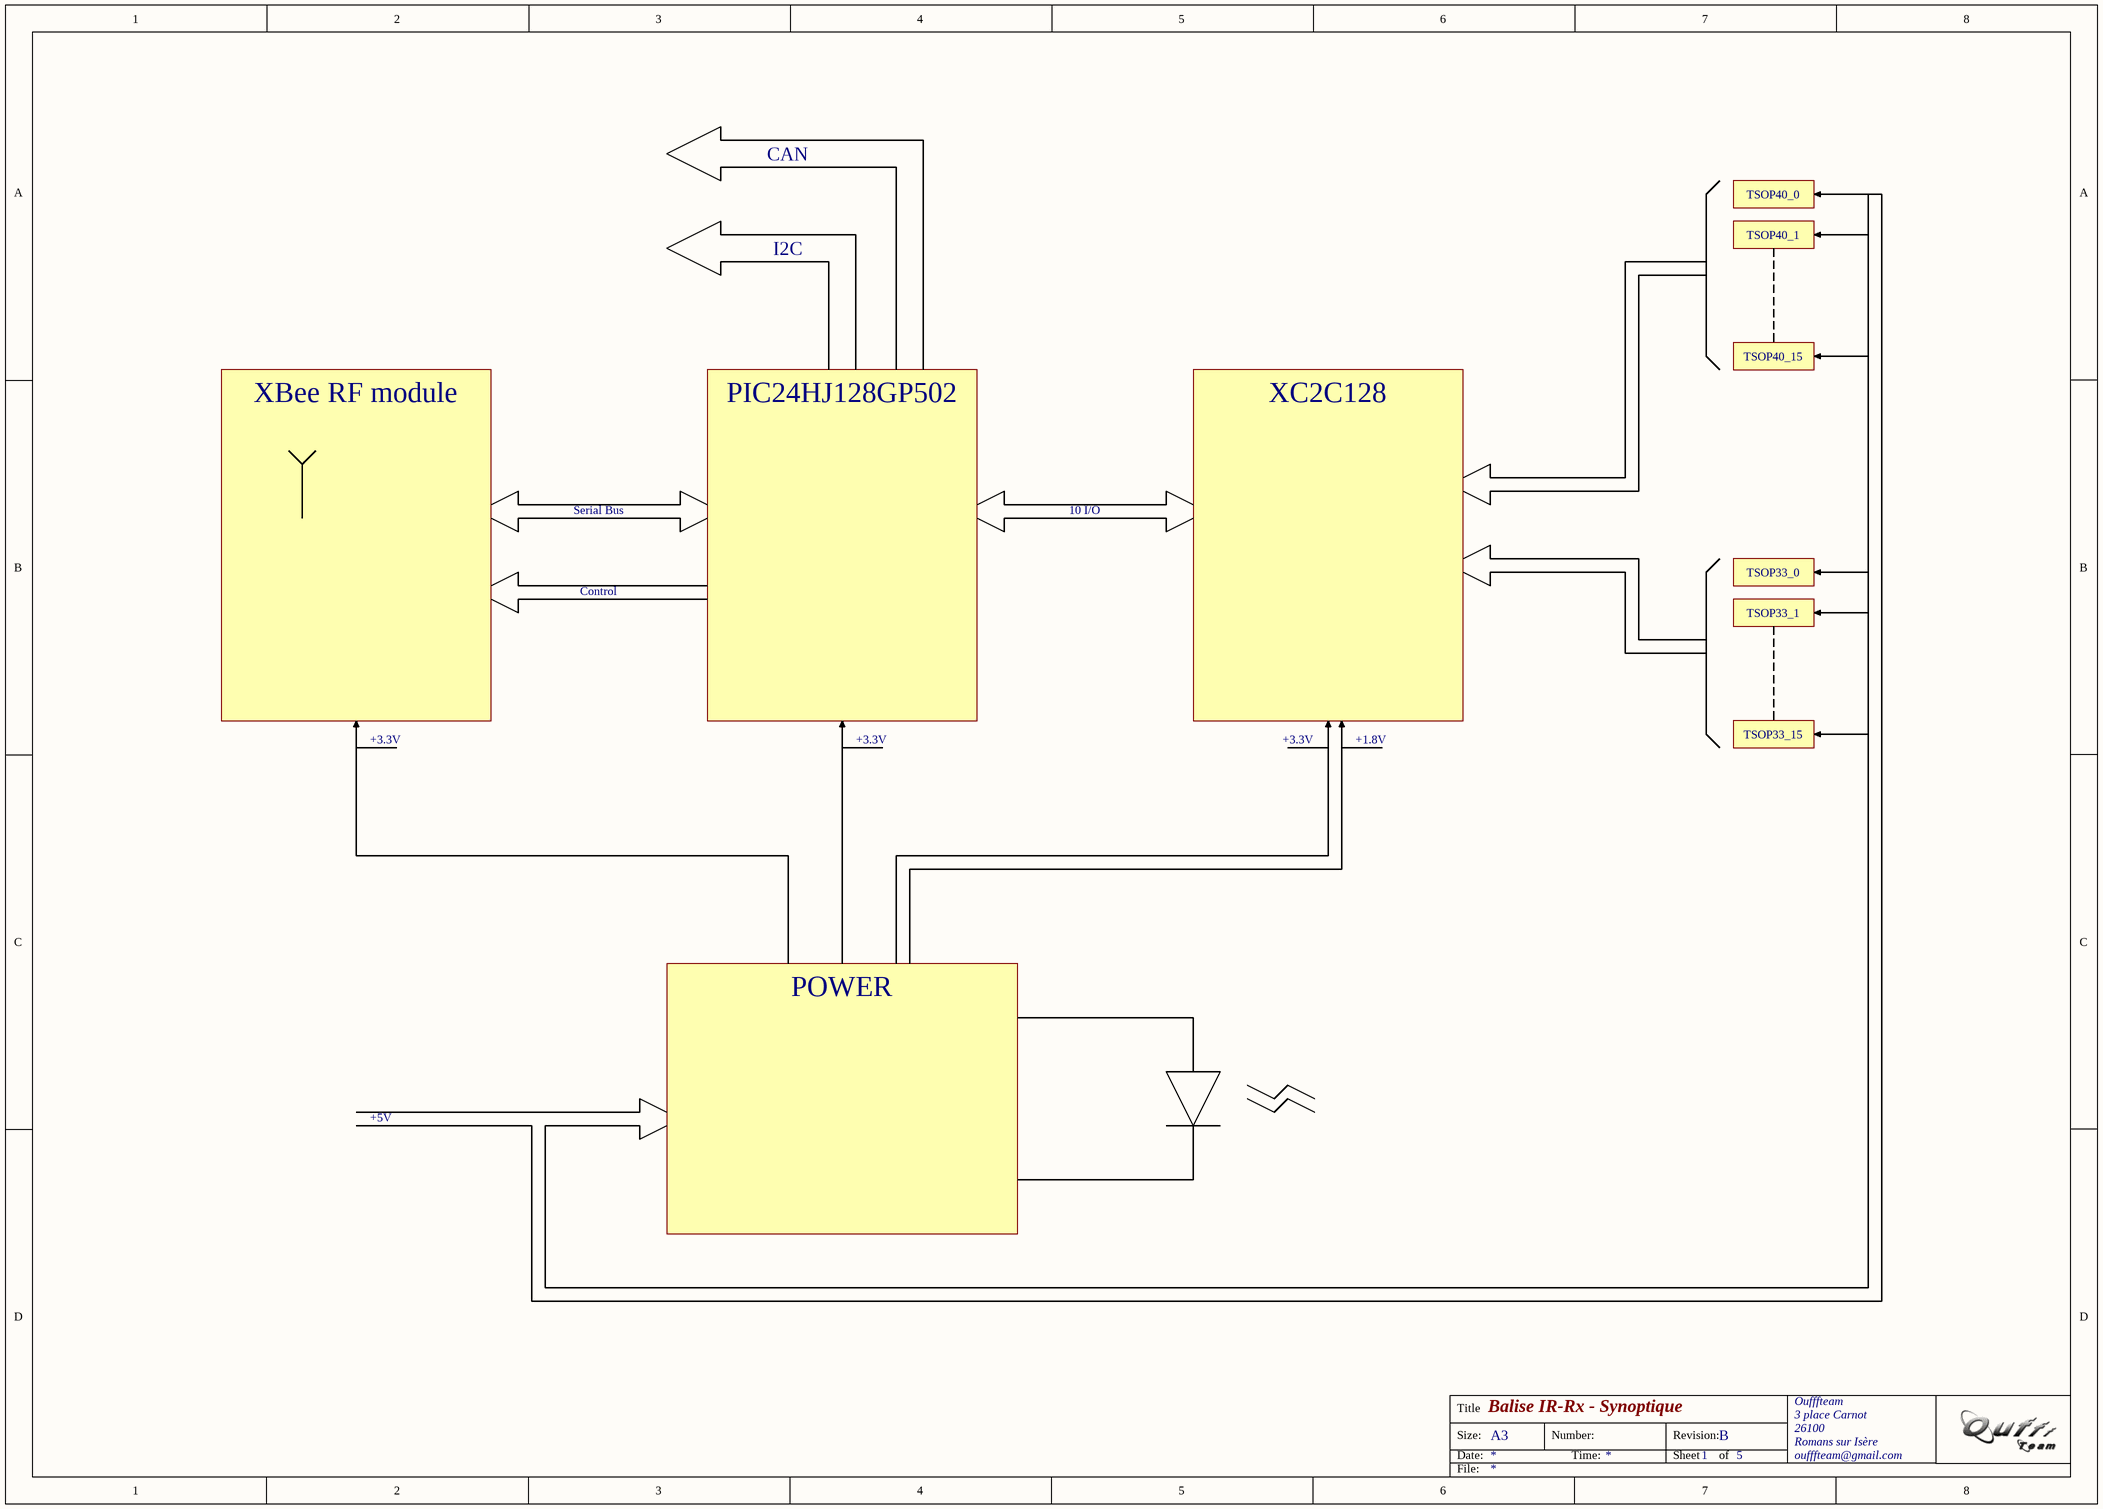
[diagram p3: Rx_syno.SchDoc]

### Notes on the sheet
- CAN
- I2C
- TSOP40_0
- TSOP40_1
- TSOP40_15
- XBee RF module
- PIC24HJ128GP502
- XC2C128
- Serial Bus
- 10 I/O
- TSOP33_0
- Control
- TSOP33_1
- +3.3V
- +1.8V
- TSOP33_15
- POWER
- +5V
- Title
- Size:
- Date:
- A3
- Number:
- Time:
- Revision:
- Sheet
- of
- Oufffteam
- 3 place Carnot
- 26100
- Romans sur Isère
- oufffteam@gmail.com
- File:

## Sheet Rx_TSOP.SchDoc: Balise IR-Rx - TSOP
size A3; Author: B Labbe; CompanyName: Oufffteam; DrawnBy: B Labbe; Engineer: B Labbe; Organization: Oufffteam; Address1: L3, 12a Rodborough Rd; Address2: Frenchs Forest; Address3: NSW; Address4: Australia 2086; Revision: B; SheetNumber: 5; SheetTotal: 5; DocumentName: Balise IR-Rx - TSOP
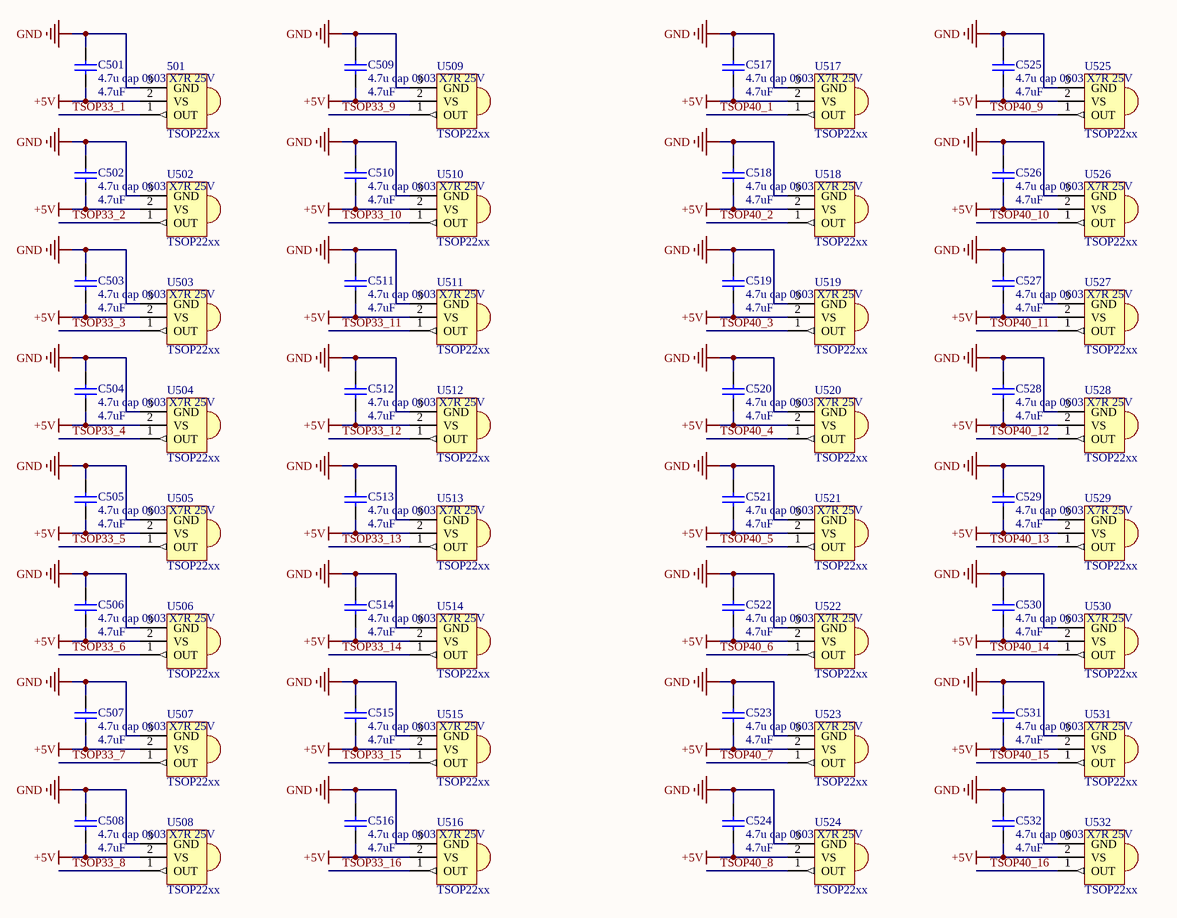
[diagram p4: Rx_TSOP.SchDoc]

### Parts
501  TSOP22xx  [TSOP22xx]
C501  4.7u cap 0603 X7R 25V  value 4.7uF  [0603]
C502  4.7u cap 0603 X7R 25V  value 4.7uF  [0603]
C503  4.7u cap 0603 X7R 25V  value 4.7uF  [0603]
C504  4.7u cap 0603 X7R 25V  value 4.7uF  [0603]
C505  4.7u cap 0603 X7R 25V  value 4.7uF  [0603]
C506  4.7u cap 0603 X7R 25V  value 4.7uF  [0603]
C507  4.7u cap 0603 X7R 25V  value 4.7uF  [0603]
C508  4.7u cap 0603 X7R 25V  value 4.7uF  [0603]
C509  4.7u cap 0603 X7R 25V  value 4.7uF  [0603]
C510  4.7u cap 0603 X7R 25V  value 4.7uF  [0603]
C511  4.7u cap 0603 X7R 25V  value 4.7uF  [0603]
C512  4.7u cap 0603 X7R 25V  value 4.7uF  [0603]
C513  4.7u cap 0603 X7R 25V  value 4.7uF  [0603]
C514  4.7u cap 0603 X7R 25V  value 4.7uF  [0603]
C515  4.7u cap 0603 X7R 25V  value 4.7uF  [0603]
C516  4.7u cap 0603 X7R 25V  value 4.7uF  [0603]
C517  4.7u cap 0603 X7R 25V  value 4.7uF  [0603]
C518  4.7u cap 0603 X7R 25V  value 4.7uF  [0603]
C519  4.7u cap 0603 X7R 25V  value 4.7uF  [0603]
C520  4.7u cap 0603 X7R 25V  value 4.7uF  [0603]
C521  4.7u cap 0603 X7R 25V  value 4.7uF  [0603]
C522  4.7u cap 0603 X7R 25V  value 4.7uF  [0603]
C523  4.7u cap 0603 X7R 25V  value 4.7uF  [0603]
C524  4.7u cap 0603 X7R 25V  value 4.7uF  [0603]
C525  4.7u cap 0603 X7R 25V  value 4.7uF  [0603]
C526  4.7u cap 0603 X7R 25V  value 4.7uF  [0603]
C527  4.7u cap 0603 X7R 25V  value 4.7uF  [0603]
C528  4.7u cap 0603 X7R 25V  value 4.7uF  [0603]
C529  4.7u cap 0603 X7R 25V  value 4.7uF  [0603]
C530  4.7u cap 0603 X7R 25V  value 4.7uF  [0603]
C531  4.7u cap 0603 X7R 25V  value 4.7uF  [0603]
C532  4.7u cap 0603 X7R 25V  value 4.7uF  [0603]
U502  TSOP22xx  [TSOP22xx]
U503  TSOP22xx  [TSOP22xx]
U504  TSOP22xx  [TSOP22xx]
U505  TSOP22xx  [TSOP22xx]
U506  TSOP22xx  [TSOP22xx]
U507  TSOP22xx  [TSOP22xx]
U508  TSOP22xx  [TSOP22xx]
U509  TSOP22xx  [TSOP22xx]
U510  TSOP22xx  [TSOP22xx]
U511  TSOP22xx  [TSOP22xx]
U512  TSOP22xx  [TSOP22xx]
U513  TSOP22xx  [TSOP22xx]
U514  TSOP22xx  [TSOP22xx]
U515  TSOP22xx  [TSOP22xx]
U516  TSOP22xx  [TSOP22xx]
U517  TSOP22xx  [TSOP22xx]
U518  TSOP22xx  [TSOP22xx]
U519  TSOP22xx  [TSOP22xx]
U520  TSOP22xx  [TSOP22xx]
U521  TSOP22xx  [TSOP22xx]
U522  TSOP22xx  [TSOP22xx]
U523  TSOP22xx  [TSOP22xx]
U524  TSOP22xx  [TSOP22xx]
U525  TSOP22xx  [TSOP22xx]
U526  TSOP22xx  [TSOP22xx]
U527  TSOP22xx  [TSOP22xx]
U528  TSOP22xx  [TSOP22xx]
U529  TSOP22xx  [TSOP22xx]
U530  TSOP22xx  [TSOP22xx]
U531  TSOP22xx  [TSOP22xx]
U532  TSOP22xx  [TSOP22xx]

### Nets
+5V: 501.2(VS) C501.1 C502.1 C503.1 C504.1 C505.1 C506.1 C507.1 C508.1 C509.1 C510.1 C511.1 C512.1 C513.1 C514.1 C515.1 C516.1 C517.1 C518.1 C519.1 C520.1 C521.1 C522.1 C523.1 C524.1 C525.1 C526.1 C527.1 C528.1 C529.1 C530.1 C531.1 C532.1 U502.2(VS) U503.2(VS) U504.2(VS) U505.2(VS) U506.2(VS) U507.2(VS) U508.2(VS) U509.2(VS) U510.2(VS) U511.2(VS) U512.2(VS) U513.2(VS) U514.2(VS) U515.2(VS) U516.2(VS) U517.2(VS) U518.2(VS) U519.2(VS) U520.2(VS) U521.2(VS) U522.2(VS) U523.2(VS) U524.2(VS) U525.2(VS) U526.2(VS) U527.2(VS) U528.2(VS) U529.2(VS) U530.2(VS) U531.2(VS) U532.2(VS)
GND: 501.3(GND) C501.2 C502.2 C503.2 C504.2 C505.2 C506.2 C507.2 C508.2 C509.2 C510.2 C511.2 C512.2 C513.2 C514.2 C515.2 C516.2 C517.2 C518.2 C519.2 C520.2 C521.2 C522.2 C523.2 C524.2 C525.2 C526.2 C527.2 C528.2 C529.2 C530.2 C531.2 C532.2 U502.3(GND) U503.3(GND) U504.3(GND) U505.3(GND) U506.3(GND) U507.3(GND) U508.3(GND) U509.3(GND) U510.3(GND) U511.3(GND) U512.3(GND) U513.3(GND) U514.3(GND) U515.3(GND) U516.3(GND) U517.3(GND) U518.3(GND) U519.3(GND) U520.3(GND) U521.3(GND) U522.3(GND) U523.3(GND) U524.3(GND) U525.3(GND) U526.3(GND) U527.3(GND) U528.3(GND) U529.3(GND) U530.3(GND) U531.3(GND) U532.3(GND)
TSOP33_1: 501.1(OUT)
TSOP33_2: U502.1(OUT)
TSOP33_3: U503.1(OUT)
TSOP33_4: U504.1(OUT)
TSOP33_5: U505.1(OUT)
TSOP33_6: U506.1(OUT)
TSOP33_7: U507.1(OUT)
TSOP33_8: U508.1(OUT)
TSOP33_9: U509.1(OUT)
TSOP33_10: U510.1(OUT)
TSOP33_11: U511.1(OUT)
TSOP33_12: U512.1(OUT)
TSOP33_13: U513.1(OUT)
TSOP33_14: U514.1(OUT)
TSOP33_15: U515.1(OUT)
TSOP33_16: U516.1(OUT)
TSOP40_1: U517.1(OUT)
TSOP40_2: U518.1(OUT)
TSOP40_3: U519.1(OUT)
TSOP40_4: U520.1(OUT)
TSOP40_5: U521.1(OUT)
TSOP40_6: U522.1(OUT)
TSOP40_7: U523.1(OUT)
TSOP40_8: U524.1(OUT)
TSOP40_9: U525.1(OUT)
TSOP40_10: U526.1(OUT)
TSOP40_11: U527.1(OUT)
TSOP40_12: U528.1(OUT)
TSOP40_13: U529.1(OUT)
TSOP40_14: U530.1(OUT)
TSOP40_15: U531.1(OUT)
TSOP40_16: U532.1(OUT)

### Notes on the sheet
- Title
- Size:
- Date:
- A3
- Number:
- Time:
- Revision:
- Sheet
- of
- Oufffteam
- 3 place Carnot
- 26100
- Romans sur Isère
- oufffteam@gmail.com
- File:

### Library data of the parts
501 U502-U532 = TSOP22xx: IR Receiver Modules for Remote Control Systems
C501-C532 = Cap: Capacitor; Published: 8-Jun-2000; LatestRevisionDate: 17-Jul-2002; LatestRevisionNote: Re-released for DXP Platform.; PackageReference: RAD-0.3; Publisher: Altium Limited

## Nets that join several sheets
+1.8V: Rx_logic (C213.2 C214.2 U201.26 U201.57), Rx_power (C310.2 PT24.1 U303.5)
+3.3V: Rx_micro (16 pins), Rx_logic (28 pins), Rx_power (6 pins)
+5V: Rx_micro (7 pins), Rx_power (15 pins), Rx_TSOP (64 pins)
GND: Rx_micro (24 pins), Rx_logic (40 pins), Rx_power (18 pins), Rx_TSOP (64 pins)
PIC_CPLD_PORT0: Rx_micro (U101.5), Rx_logic (U201.13)
PIC_CPLD_PORT1: Rx_micro (U101.4), Rx_logic (PT11.1 U201.14)
PIC_CPLD_PORT2: Rx_micro (U101.3), Rx_logic (PT12.1 U201.15)
PIC_CPLD_PORT3: Rx_micro (U101.2), Rx_logic (U201.16)
PIC_CPLD_PORT4: Rx_micro (U101.43), Rx_logic (U201.17)
PIC_CPLD_PORT5: Rx_micro (U101.42), Rx_logic (U201.18)
PIC_CPLD_PORT6: Rx_micro (U101.41), Rx_logic (U201.23)
PIC_CPLD_PORT7: Rx_micro (U101.38), Rx_logic (U201.24)
PIC_CPLD_PORT8: Rx_micro (U101.37), Rx_logic (U201.28)
PIC_CPLD_PORT9: Rx_micro (U101.36), Rx_logic (U201.29)
TSOP33_1: Rx_logic (U203.2), Rx_TSOP (501.1)
TSOP33_2: Rx_logic (U203.6), Rx_TSOP (U502.1)
TSOP33_3: Rx_logic (U203.11), Rx_TSOP (U503.1)
TSOP33_4: Rx_logic (U203.15), Rx_TSOP (U504.1)
TSOP33_5: Rx_logic (U204.2), Rx_TSOP (U505.1)
TSOP33_6: Rx_logic (U204.6), Rx_TSOP (U506.1)
TSOP33_7: Rx_logic (U204.11), Rx_TSOP (U507.1)
TSOP33_8: Rx_logic (U204.15), Rx_TSOP (U508.1)
TSOP33_9: Rx_logic (U205.2), Rx_TSOP (U509.1)
TSOP33_10: Rx_logic (U205.6), Rx_TSOP (U510.1)
TSOP33_11: Rx_logic (U205.11), Rx_TSOP (U511.1)
TSOP33_12: Rx_logic (U205.15), Rx_TSOP (U512.1)
TSOP33_13: Rx_logic (U206.2), Rx_TSOP (U513.1)
TSOP33_14: Rx_logic (U206.6), Rx_TSOP (U514.1)
TSOP33_15: Rx_logic (U206.11), Rx_TSOP (U515.1)
TSOP33_16: Rx_logic (U206.15), Rx_TSOP (U516.1)
TSOP40_1: Rx_logic (U203.4), Rx_TSOP (U517.1)
TSOP40_2: Rx_logic (U203.8), Rx_TSOP (U518.1)
TSOP40_3: Rx_logic (U203.13), Rx_TSOP (U519.1)
TSOP40_4: Rx_logic (U203.17), Rx_TSOP (U520.1)
TSOP40_5: Rx_logic (U204.4), Rx_TSOP (U521.1)
TSOP40_6: Rx_logic (U204.8), Rx_TSOP (U522.1)
TSOP40_7: Rx_logic (U204.13), Rx_TSOP (U523.1)
TSOP40_8: Rx_logic (U204.17), Rx_TSOP (U524.1)
TSOP40_9: Rx_logic (U205.4), Rx_TSOP (U525.1)
TSOP40_10: Rx_logic (U205.8), Rx_TSOP (U526.1)
TSOP40_11: Rx_logic (U205.13), Rx_TSOP (U527.1)
TSOP40_12: Rx_logic (U205.17), Rx_TSOP (U528.1)
TSOP40_13: Rx_logic (U206.4), Rx_TSOP (U529.1)
TSOP40_14: Rx_logic (U206.8), Rx_TSOP (U530.1)
TSOP40_15: Rx_logic (U206.13), Rx_TSOP (U531.1)
TSOP40_16: Rx_logic (U206.17), Rx_TSOP (U532.1)
VISION_ENABLE: Rx_micro (U101.34), Rx_power (PT16.1 U301.2)